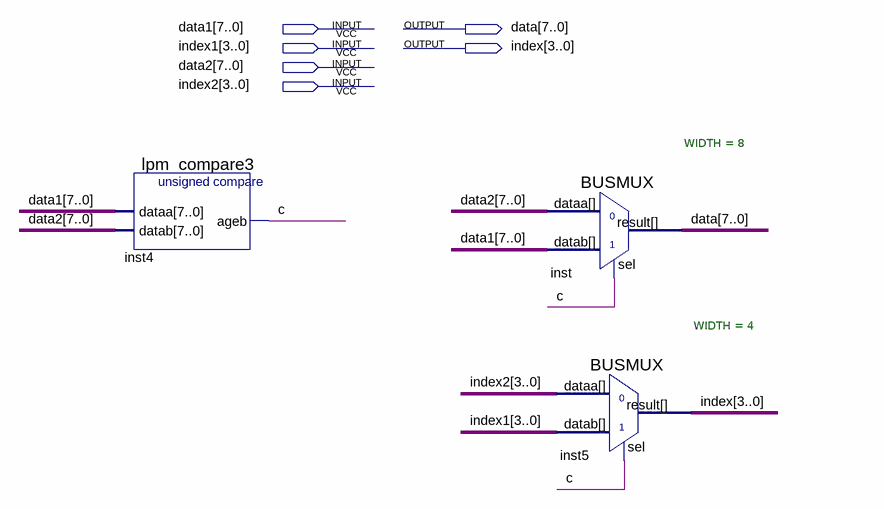
[diagram p0: schematic sheet]
// Quartus schematic LRU_block.bdf as structural Verilog: 3 symbols, 6 pins
module LRU_block (
  input  [7:0] data1,
  input  [3:0] index1,
  input  [7:0] data2,
  input  [3:0] index2,
  output [7:0] data,
  output [3:0] index
);

  wire c;

  lpm_compare3 inst4 (.dataa(data1), .datab(data2), .ageb(c));
  BUSMUX #(.WIDTH(8)) inst (.datab(data1), .sel(c), .dataa(data2), .result(data));
  BUSMUX #(.WIDTH(4)) inst5 (.datab(index1), .sel(c), .dataa(index2), .result(index));
endmodule
